# EAGLE design humidor_controller_v10 (EAGLE 5.06)
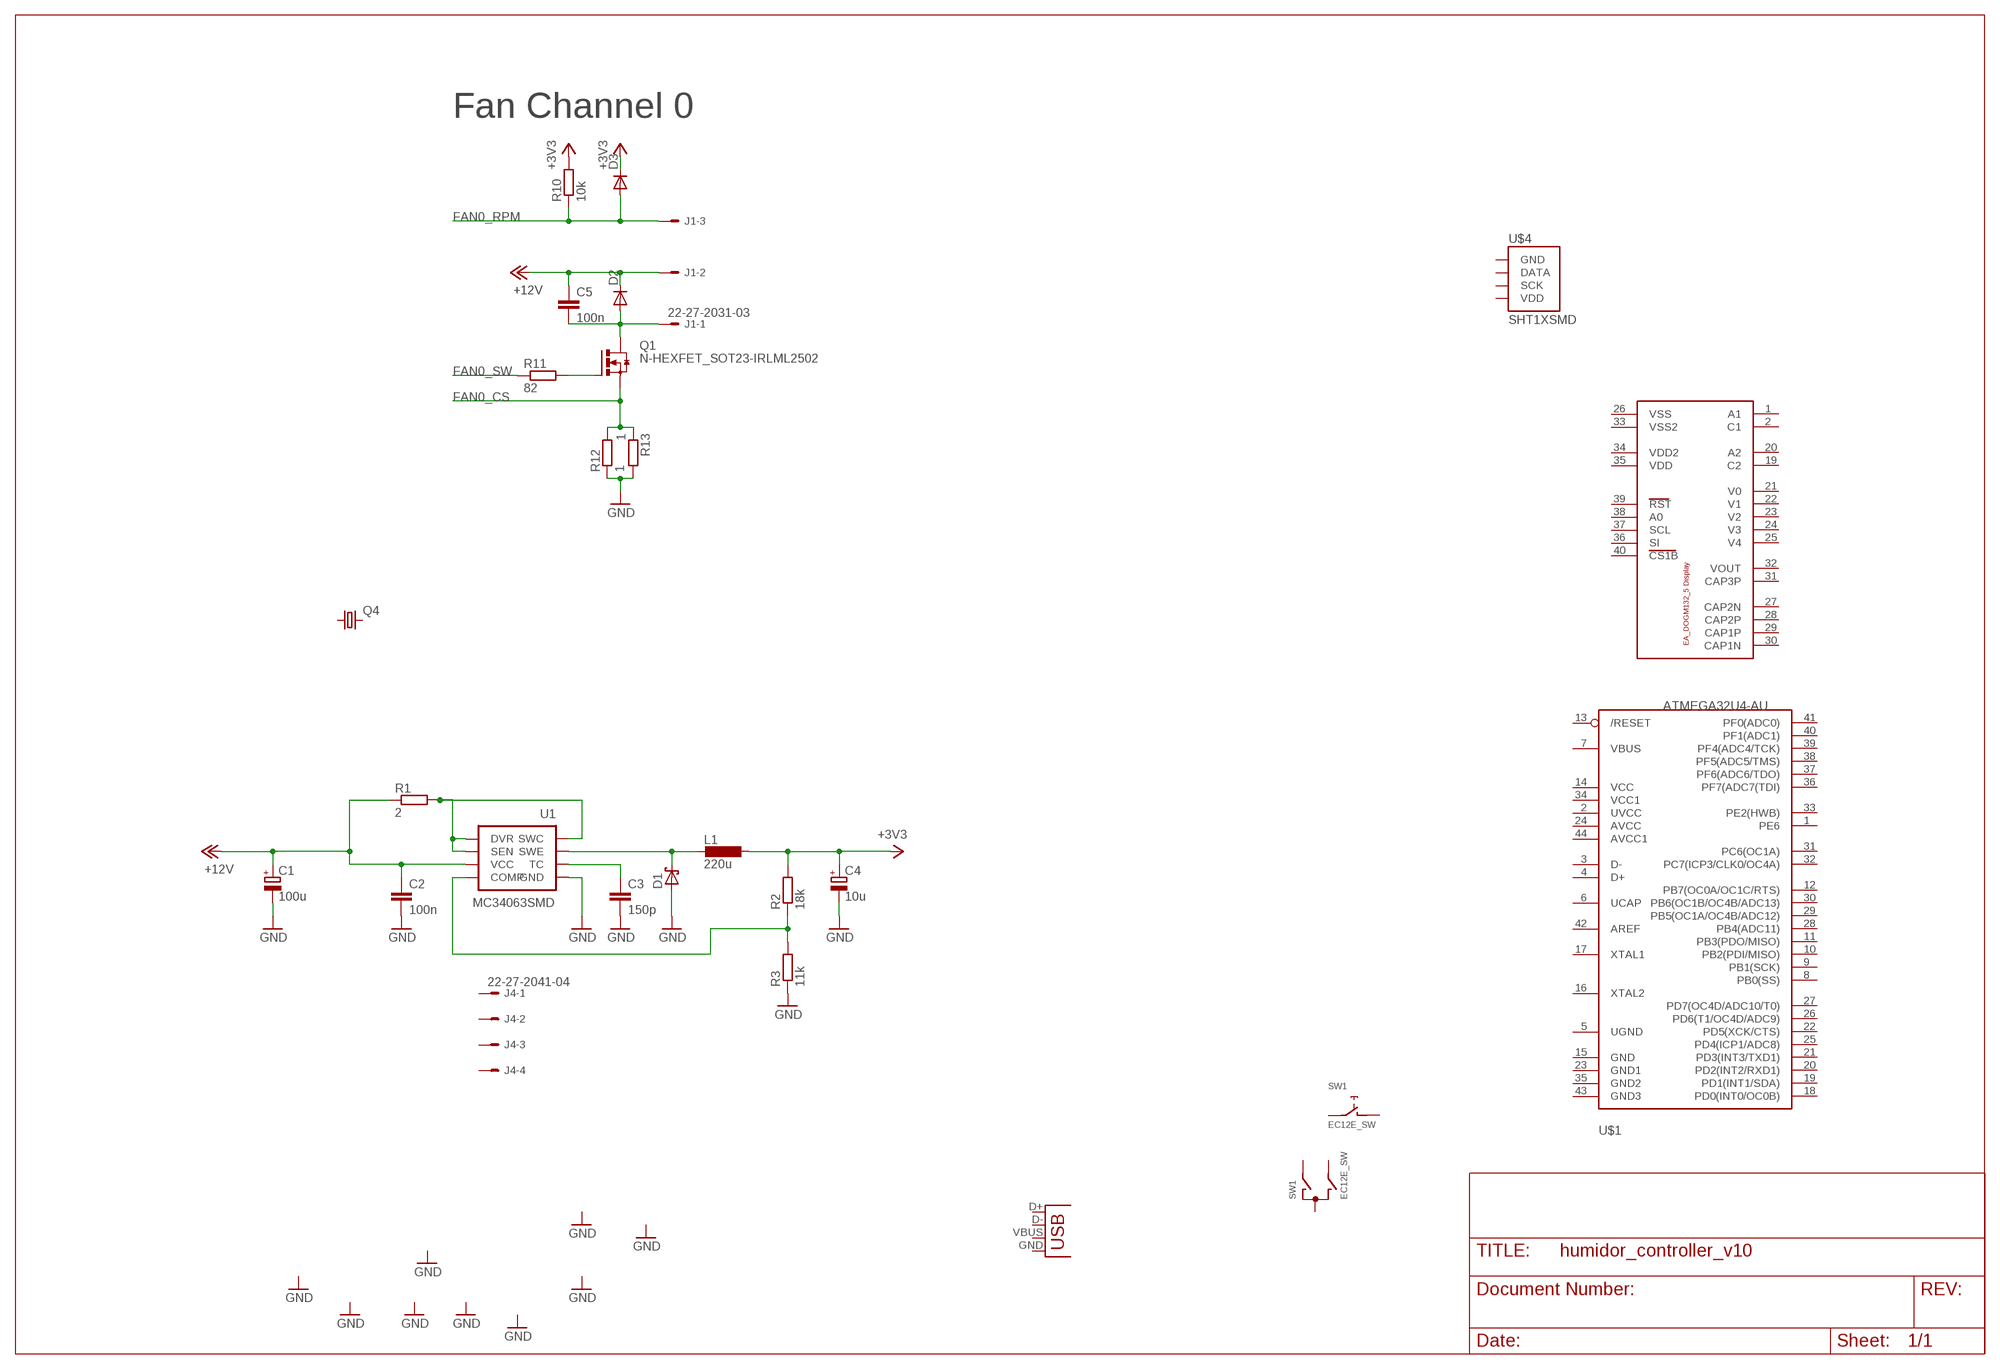
[diagram p0: schematic, sheet 1]

## Parts
C1  100u  CPOL-EUD  [PANASONIC_D]
C2  100n  C-EUC0805  [C0805]
C3  150p  C-EUC0805  [C0805]
C4  10u  CPOL-EUB  [PANASONIC_B]
C5  100n  C-EUC0805  [C0805]
D1  SCHOTTKY-DIODESOD123  [SOD123]
D2  DIODE-SOD323-R  [SOD323-R]
D3  DIODE-SOD323-R  [SOD323-R]
J1  22-27-2031-03  [6410-03]
J4  22-27-2041-04  [6410-04]
L1  220u  L-EUPIS2816  [PIS2816]
Q1  N-HEXFET_SOT23-IRLML2502  [SOT23]
Q4  CRYSTALHC49UP  [HC49UP]
R1  2  R-EU_R0805  [R0805]
R2  18k  R-EU_R0805  [R0805]
R3  11k  R-EU_R0805  [R0805]
R10  10k  R-EU_R0805  [R0805]
R11  82  R-EU_R0805  [R0805]
R12  1  R-EU_R1206  [R1206]
R13  1  R-EU_R1206  [R1206]
SW1  EC12E_SW  [ALPS_EC12E_SW]
U1  MC34063SMD  [SO08]
U$1  ATMEGA32U4-AU  [TQFP44]
U$2  EA_DOG-M_DISPLAY  [E_DOG-M_DISPLAY]
U$4  SHT1XSMD  [SHT1X]
X4  USBSMD  [USB-MINIB]

## Nets
+3V3: C4.+ D3.C L1.1 R2.2 R10.2
+12V: C1.+ C2.1 C5.1 D2.C J1.2 R1.1 U1.6(VCC)
FAN0_CS: Q1.2(S) R12.2 R13.1
FAN0_RPM: D3.A J1.3 R10.1
FAN0_SW: R11.1
GND: C1.- C2.2 C3.2 C4.- D1.A R3.1 R12.1 R13.2 U1.4(GND)
N$1: C5.2 D2.A J1.1 Q1.3(D)
N$2: R1.2 U1.1(SWC) U1.7(SEN) U1.8(DVR)
N$3: C3.1 U1.3(TC)
N$4: D1.C L1.2 U1.2(SWE)
N$5: R2.1 R3.2 U1.5(COMP)
N$9: Q1.1(G) R11.2
Unconnected: J4.1 J4.2 J4.3 J4.4 Q4.1 Q4.2 SW1.A SW1.B SW1.C SW1.D SW1.E SW1.GND1(G) SW1.GND2(G) U$1.1(PE6) U$1.2(UVCC) U$1.3(D-) U$1.4(D+) U$1.5(UGND) U$1.6(UCAP) U$1.7(VBUS) U$1.8(PB0(SS)) U$1.9(PB1(SCK)) U$1.10(PB2(PDI/MISO)) U$1.11(PB3(PDO/MISO)) U$1.12(PB7(OC0A/OC1C/RTS)) U$1.13(/RESET) U$1.14(VCC) U$1.15(GND) U$1.16(XTAL2) U$1.17(XTAL1) U$1.18(PD0(INT0/OC0B)) U$1.19(PD1(INT1/SDA)) U$1.20(PD2(INT2/RXD1)) U$1.21(PD3(INT3/TXD1)) U$1.22(PD5(XCK/CTS)) U$1.23(GND1) U$1.24(AVCC) U$1.25(PD4(ICP1/ADC8)) U$1.26(PD6(T1/OC4D/ADC9)) U$1.27(PD7(OC4D/ADC10/T0)) U$1.28(PB4(ADC11)) U$1.29(PB5(OC1A/OC4B/ADC12)) U$1.30(PB6(OC1B/OC4B/ADC13)) U$1.31(PC6(OC1A)) U$1.32(PC7(ICP3/CLK0/OC4A)) U$1.33(PE2(HWB)) U$1.34(VCC1) U$1.35(GND2) U$1.36(PF7(ADC7(TDI)) U$1.37(PF6(ADC6/TDO)) U$1.38(PF5(ADC5/TMS)) U$1.39(PF4(ADC4/TCK)) U$1.40(PF1(ADC1)) U$1.41(PF0(ADC0)) U$1.42(AREF) U$1.43(GND3) U$1.44(AVCC1) U$2.1(A1) U$2.2(C1) U$2.19(C2) U$2.20(A2) U$2.23(V2) U$2.24(V3) U$2.25(V4) U$2.26(VSS) U$2.27(CAP2N) U$2.28(CAP2P) U$2.29(CAP1P) U$2.30(CAP1N) U$2.31(CAP3P) U$2.32(VOUT) U$2.33(VSS2) U$2.34(VDD2) U$2.35(VDD) U$2.36(SI) U$2.37(SCL) U$2.38(A0) U$2.39(RST) U$2.40(CS1B) U$4.2(DATA) U$4.3(SCK) X4.D+ X4.D- X4.GND X4.VBUS

## Notes on the sheet
- Fan Channel 0

## Power pins joined to a net without a drawn wire
GND: U$4.1(GND)
V0: U$2.21(V0)
V1: U$2.22(V1)
VDD: U$4.4(VDD)

## Library data of the parts
C1 C4 = rcl:CPOL-EU: POLARIZED CAPACITOR, European symbol
C2 C3 C5 = resistor:C-EU: CAPACITOR, European symbol
D1 = ferdinandkeil:SCHOTTKY-DIODE: Schottky Diode
D2 D3 = diode:DIODE-: DIODE
J1 = con-molex:22-?-03: CONNECTOR wire to board 2.54 mm (.1 inch) pitch header
J4 = con-molex:22-?-04: CONNECTOR wire to board 2.54 mm (.1 inch) pitch header
L1 = rcl:L-EU: INDUCTOR, European symbol
Q1 = ferdinandkeil:N-HEXFET_?-*: HEXFET® Power MOSFET
Q4 = crystal:CRYSTAL: CRYSTAL
R1-R3 R10-R13 = resistor:R-EU_: RESISTOR, European symbol
SW1 = switch-alps:EC12E_SW: ALPS rotary Encoder EC12E series with switch
U1 = SparkFun:MC34063
U$1 = adafruit:ATMEGA32U4: http://www.ladyada.net/library/eagle
U$2 = display_ea_dogm132:EA_DOG-M_DISPLAY
U$4 = SparkFun:SHT1X: SHT1x Humdity Sensor Sensirion humdity sensor. Schematic element and footprint proven. Spark Fun Electronics SKU : COM-08227
X4 = SparkFun:USB: USB Connectors USB-B-PTH is fully proven SKU : PRT-00139 USB-miniB is fully proven SKU : PRT-00587 USB-A-PCB is untested. USB-A-H is throughly reviewed, but untested. Spark Fun Electronics SKU : PRT-00437 USB-B-SMT is throughly reviewed, but untested. Needs silkscreen touching up. USB-A-S has not been used/tested USB-MB-H has not been used/tested

## Board
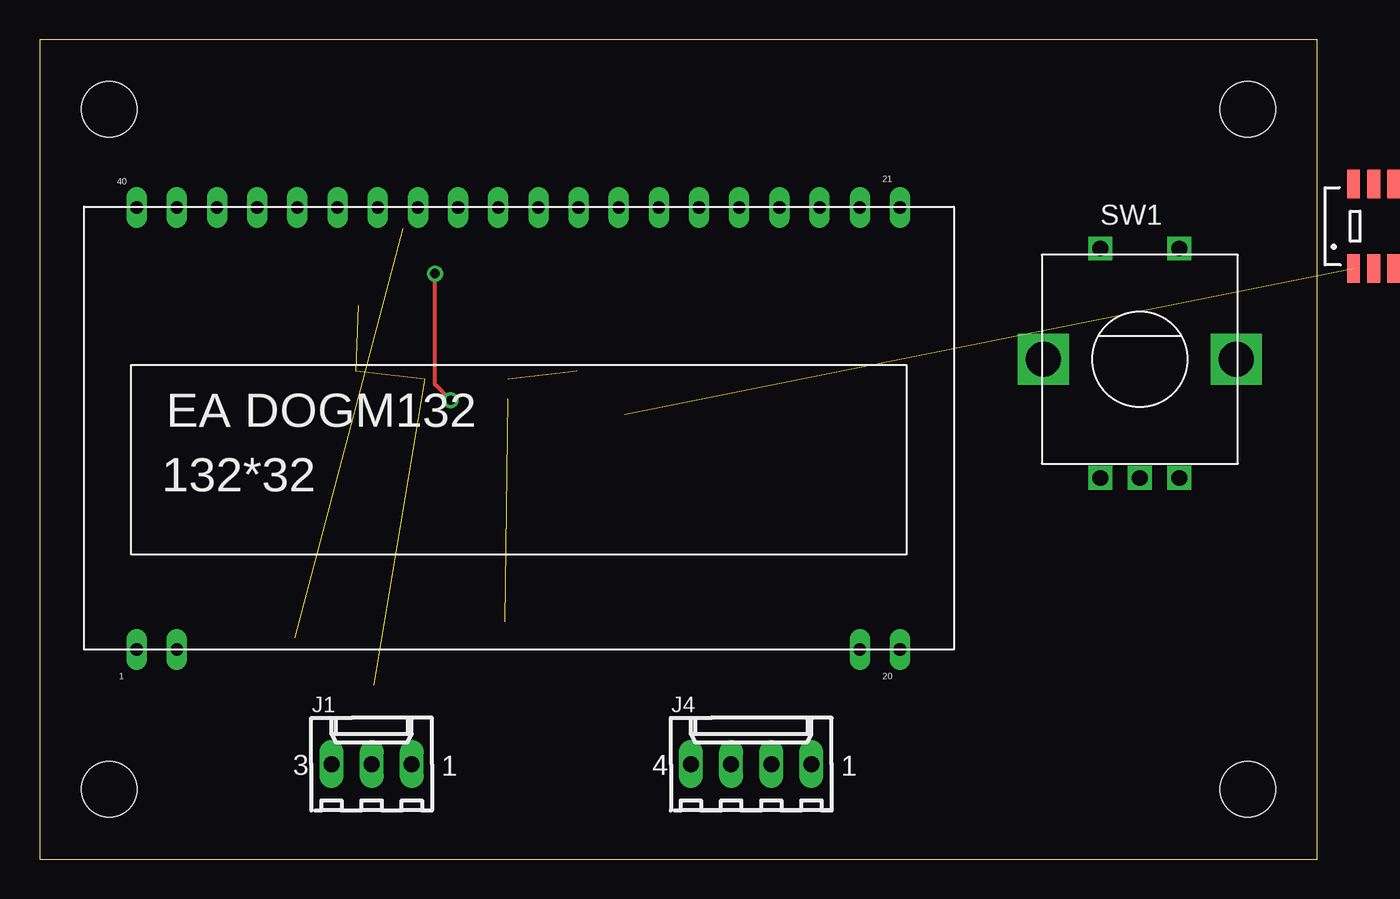
[diagram p1: board, top side]
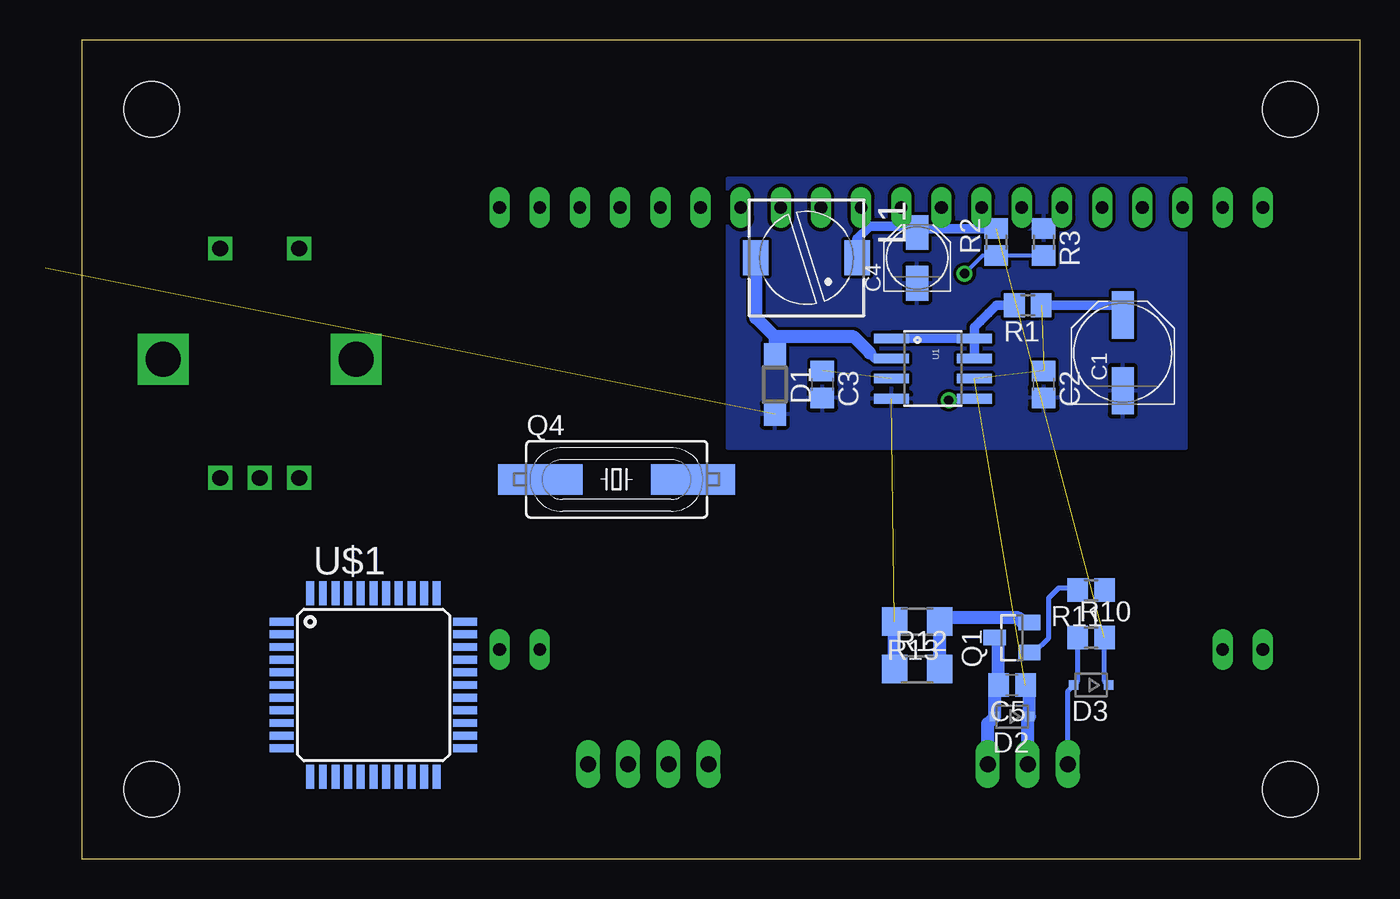
[diagram p2: board, bottom side, seen from below]

Size 80.8 x 51.8 mm. Coordinates in mm from the lower left corner, seen from the top.
Outline: 0,0 80.8,0 80.8,51.8 0,51.8 0,0
Copper layers (1*16): Top 0.035mm / dielectric 1.5mm / Bottom 0.035mm
Design rules "default": minimum track width 10mil, minimum drill 24mil, track to track 8mil, track to pad 8mil, pad to pad 8mil, via to via 8mil, smd to smd 8mil, copper to edge 40mil, drill to drill 8mil, minimum pad ring 10mil, minimum via ring 8mil, stop-mask expansion 4mil, vias tented up to drill 0mil, thermal gap 10mil
Holes 3.5 mm at 4.4,4.4 76.4,4.4 4.4,47.4 76.4,47.4

### Footprints (pad centres in the part's own frame; a part is rotated, then mirrored left to right if it is on the bottom)
PANASONIC_D = smd 3 x 1.4: + 2.4,0; - -2.4,0
C0805 = smd 1.3 x 1.5: 1 -0.85,0; 2 0.85,0
PANASONIC_B = smd 2.2 x 1.4: + 1.6,0; - -1.6,0
SOD123 = smd 1.4 x 1.4: A 1.9,0; C -1.9,0
SOD323-R = smd 0.6 x 0.6: A 1.1,0; C -1.1,0
6410-03 = drill 1.016 long: 1 2.54,0; 2 0,0; 3 -2.54,0
6410-04 = drill 1.016 long: 1 3.81,0; 2 1.27,0; 3 -1.27,0; 4 -3.81,0
PIS2816 = smd 2.2 x 1.6: 1 0,3.2; 2 0,-3.2
SOT23 = smd 1 x 1.4: 1 -0.95,-1.1; 2 0.95,-1.1; 3 0,1.1
HC49UP = smd 5.334 x 1.93: 1 -4.826,0; 2 4.826,0
R0805 = smd 1.3 x 1.5: 1 -0.85,0; 2 0.85,0
R1206 = smd 1.6 x 1.803: 1 -1.422,0; 2 1.422,0
ALPS_EC12E_SW = drill 1 square: A -2.5,-7.5; B 2.5,-7.5; C 0,-7.5; D -2.5,7; E 2.5,7 | drill 2.2 square: GND1 -6.1,0; GND2 6.1,0
SO08 = smd 0.61 x 2.21: 1 -1.905,-2.616; 2 -0.635,-2.616; 3 0.635,-2.616; 4 1.905,-2.616; 5 1.905,2.616; 6 0.635,2.616; 7 -0.635,2.616; 8 -1.905,2.616
TQFP44 = smd 1.5 x 0.5: 1 -5.8,4; 2 -5.8,3.2; 3 -5.8,2.4; 4 -5.8,1.6; 5 -5.8,0.8; 6 -5.8,0; 7 -5.8,-0.8; 8 -5.8,-1.6; 9 -5.8,-2.4; 10 -5.8,-3.2; 11 -5.8,-4; 23 5.8,-4; 24 5.8,-3.2; 25 5.8,-2.4; 26 5.8,-1.6; 27 5.8,-0.8; 28 5.8,0; 29 5.8,0.8; 30 5.8,1.6; 31 5.8,2.4; 32 5.8,3.2; 33 5.8,4 | smd 0.5 x 1.5: 12 -4,-5.8; 13 -3.2,-5.8; 14 -2.4,-5.8; 15 -1.6,-5.8; 16 -0.8,-5.8; 17 0,-5.8; 18 0.8,-5.8; 19 1.6,-5.8; 20 2.4,-5.8; 21 3.2,-5.8; 22 4,-5.8; 34 4,5.8; 35 3.2,5.8; 36 2.4,5.8; 37 1.6,5.8; 38 0.8,5.8; 39 0,5.8; 40 -0.8,5.8; 41 -1.6,5.8; 42 -2.4,5.8; 43 -3.2,5.8; 44 -4,5.8
E_DOG-M_DISPLAY = drill 0.8 long: 1 3.334,0; 2 5.874,0; 19 49.054,0; 20 51.594,0; 21 51.594,27.94; 22 49.054,27.94; 23 46.514,27.94; 24 43.974,27.94; 25 41.434,27.94; 26 38.894,27.94; 27 36.354,27.94; 28 33.814,27.94; 29 31.274,27.94; 30 28.734,27.94; 31 26.194,27.94; 32 23.654,27.94; 33 21.114,27.94; 34 18.574,27.94; 35 16.034,27.94; 36 13.494,27.94; 37 10.954,27.94; 38 8.414,27.94; 39 5.874,27.94; 40 3.334,27.94
SHT1X = smd 1.8 x 0.8: 1 -2.667,1.905; 2 -2.667,0.635; 3 -2.667,-0.635; 4 -2.667,-1.905; 5 2.667,-1.905; 6 2.667,-0.635; 7 2.667,0.635; 8 2.667,1.905
USB-MINIB = smd 2.5 x 0.5: D+ 2.5,0; D- 2.5,0.8; GND 2.5,-1.6; ID 2.5,-0.8; VBUS 2.5,1.6 | smd 2.5 x 2: GND@1 -3,-4.5; GND@2 -3,4.5; GND@3 2.5,4.5; GND@4 2.5,-4.5 | hole 0.9: 0,2.2; 0,-2.2

### Placement (x,y rotation side)
C1  15,32 90 bottom
C2  20,30 270 bottom
C3  34,30 270 bottom
C4  28,38 90 bottom
C5  22,11 180 bottom
D1  37,30 270 bottom
D2  22,9 180 bottom
D3  17,11 180 bottom
J1  21,6 0 top
J4  45,6 0 top
L1  35,38 270 bottom
Q1  22,14 90 bottom
Q4  47,24 0 bottom
R1  21,35 180 bottom
R2  23,39 90 bottom
R3  20,39 270 bottom
R10  17,14 0 bottom
R11  17,17 180 bottom
R12  28,12 0 bottom
R13  28,15 180 bottom
SW1  69.58,31.59 0 top
U1  27,31 270 bottom
U$1  62.38,11 0 bottom
U$2  2.81,13.24 0 top
U$4  85,40 90 top
X4  -20,6 0 top  (outside the outline)

### Tracks (layer width: path | path; a pad name or v marks a point on that pad's centre or on a via)
+3V3  (1 unrouted)
  Bottom 0.305: R10.2 16.15,11.25 D3.C
  Bottom 0.61: L1.1 31.8,39.2 31,40 28.4,40 C4.+ 27.75,39.85 R2.2
+12V  (3 unrouted)
  Bottom 0.61: R1.1 15.6,35 C1.+
  Bottom 0.813: J1.2 21,8.9 D2.C 20.9,10.75 C5.1
FAN0_CS
  Bottom 0.813: Q1.2 21.3,14.95 21.59,15.24 26.34,15.24 R13.1 R12.2
FAN0_RPM
  Bottom 0.305: J1.3 18.46,10.64 D3.A 17.85,11.25 R10.1
GND  (2 unrouted)
  Bottom 0.813: R12.1 R13.2
  pour Bottom: 11,43 40,43 40,26 11,26
N$1
  Bottom 0.813: J1.1 23.54,8.56 D2.A 23.1,10.75 C5.2 22.85,13.75 Q1.3
N$2
  Bottom 0.61: U1.8 U1.7 | U1.8 U1.1 | R1.2 23,35 23.5,34.5 | 23.5,34.5 24,34 | U1.8 24.38,33.62 23.5,34.5
N$3  (1 unrouted)
N$4
  Bottom 0.61: U1.2 30.64,31.64 31,32
  Bottom 0.813: 31,32 32,33 37,33 | 37,33 D1.C | L1.2 38.2,34.2 37,33
N$5  (via drill 0.6)
  Top 0.254: v25,37 25,30 v26,29
  Bottom 0.254: R3.2 R2.1 23.85,38.15 v25,37 | v26,29 24.48,29 U1.5
N$9
  Bottom 0.305: Q1.1 20.61,13.05 19.68,13.97 19.68,16.51 19.05,17.14 18,17.14 R11.2

### Text on the board
Document: Maße Aluminium Frontplatte | Maße Gehäuse Innen (ohne Leiterplatten Führungen)